# Altium schematic sheet Module02.SchDoc
size A
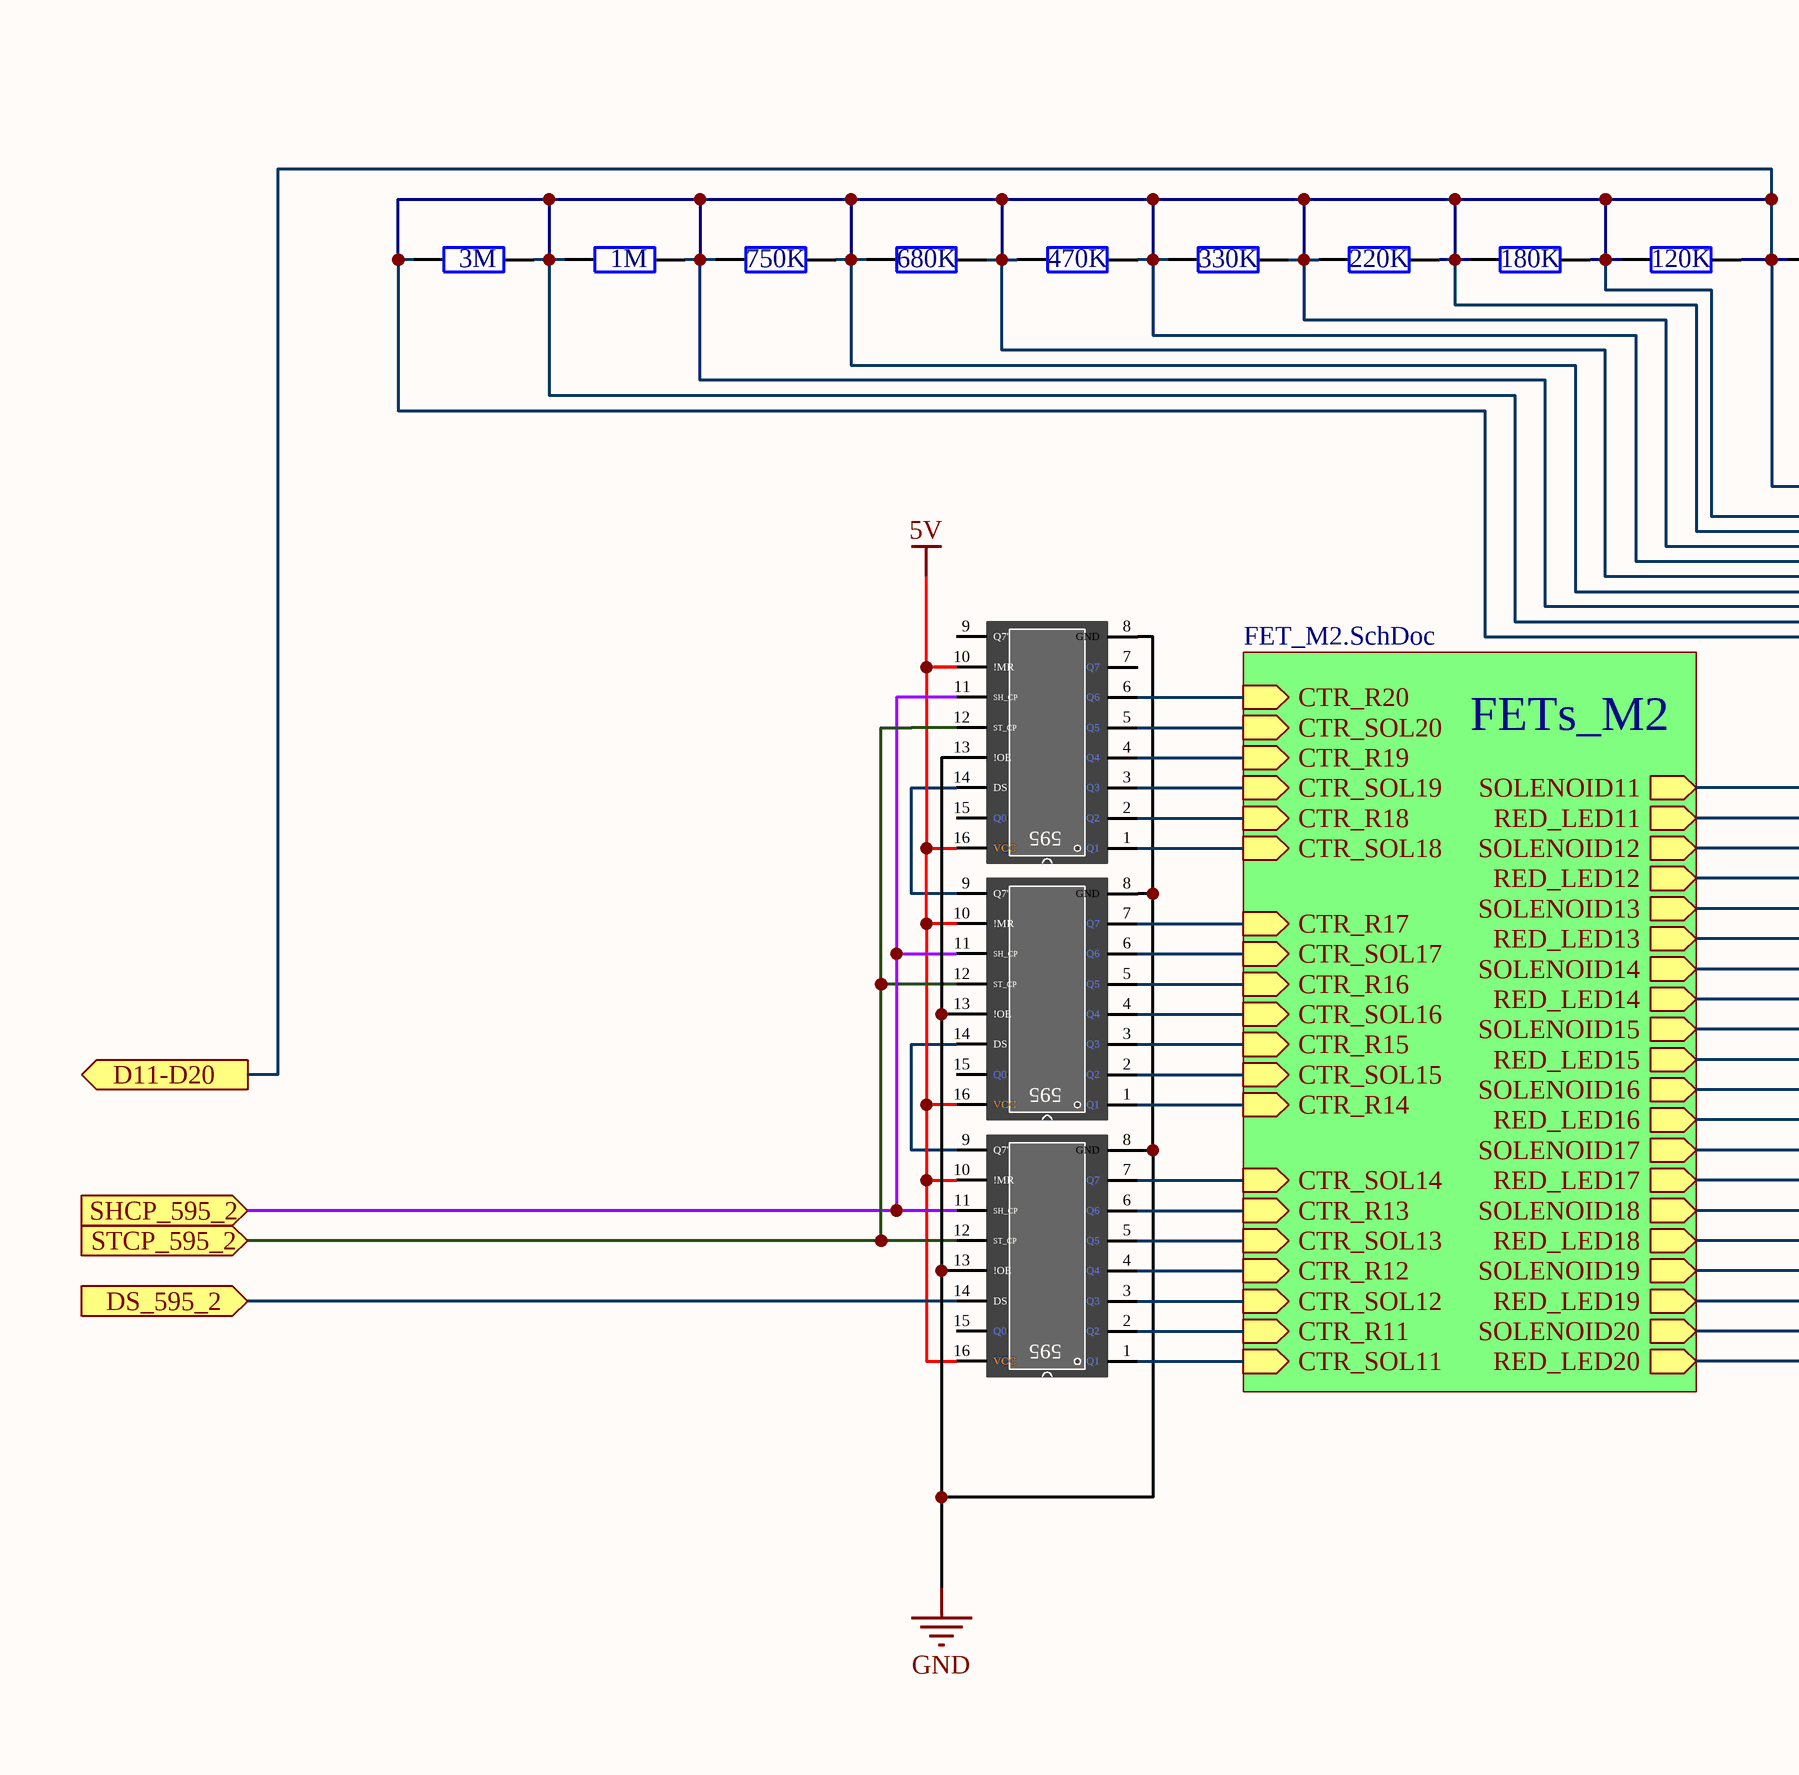
[diagram p0: Module02.SchDoc, left]
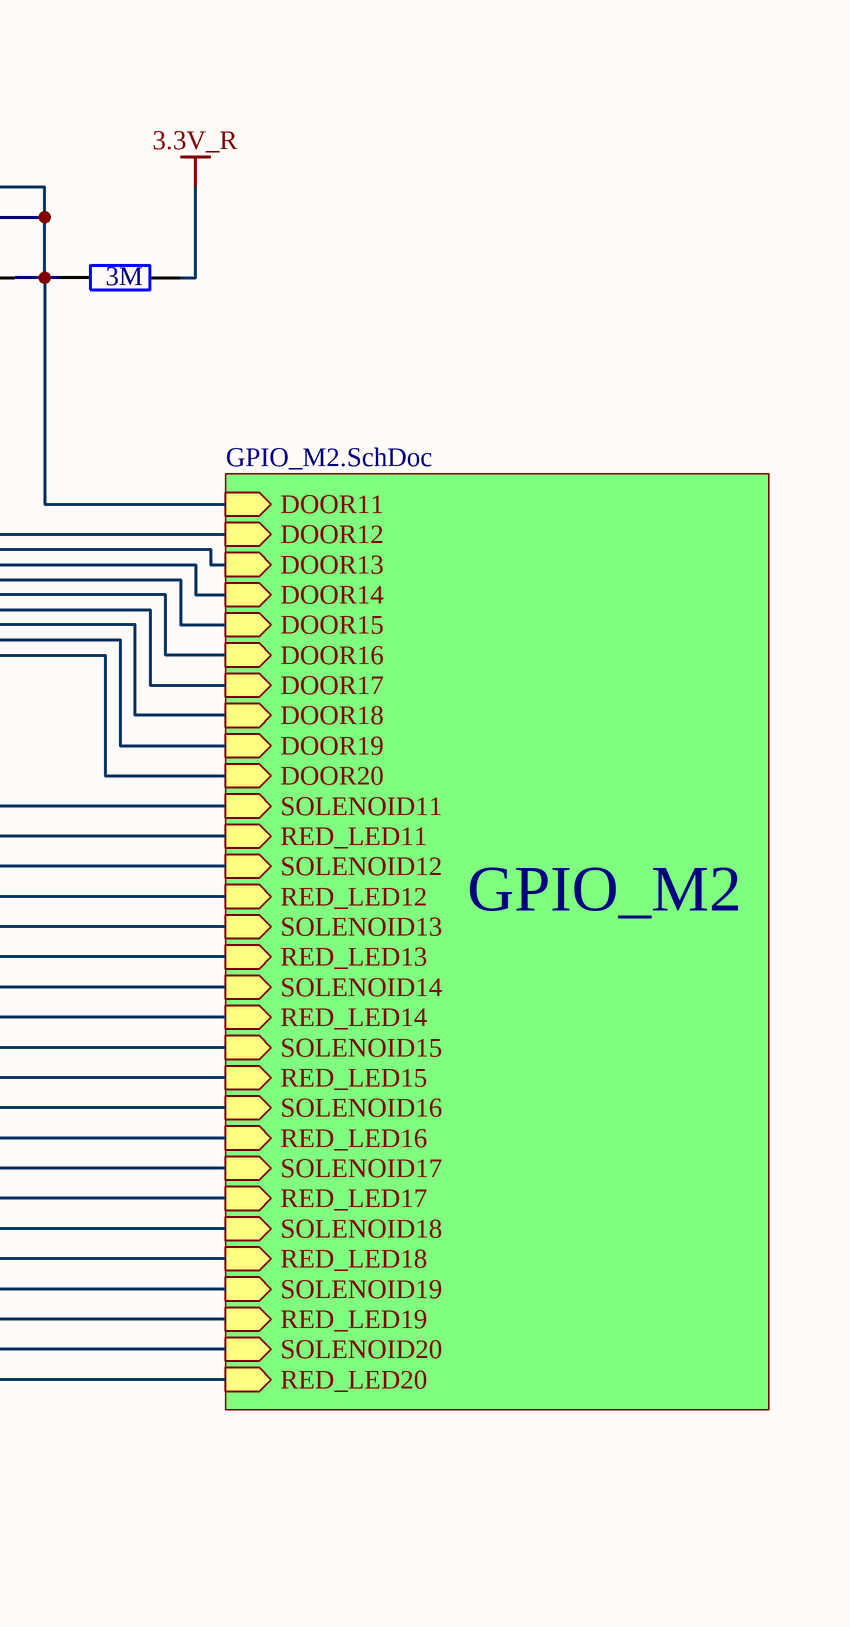
[diagram p1: Module02.SchDoc, right]

## Parts
4  5#HC74595  [5#HC74595]  (value not drawn)
5  5#HC74595  [5#HC74595]  (value not drawn)
6  5#HC74595  [5#HC74595]  (value not drawn)
R11  3M  [AXIAL-0.4]
R12  1M  [AXIAL-0.4]
R58  750K  [AXIAL-0.4]
R59  680K  [AXIAL-0.4]
R60  470K  [AXIAL-0.4]
R61  330K  [AXIAL-0.4]
R62  220K  [AXIAL-0.4]
R63  180K  [AXIAL-0.4]
R64  120K  [AXIAL-0.4]
R65  3M  [AXIAL-0.4]

## Sub-sheets
FETs_M2 = FET_M2.SchDoc: CTR_SOL11 (in), CTR_R11 (in), SOLENOID11 (out), RED_LED11 (out), CTR_SOL14 (in), CTR_R14 (in), SOLENOID14 (out), RED_LED14 (out), CTR_SOL17 (in), CTR_R17 (in), SOLENOID17 (out), RED_LED17 (out), CTR_SOL19 (in), CTR_R19 (in), SOLENOID19 (out), RED_LED19 (out), CTR_SOL12 (in), CTR_R12 (in), SOLENOID12 (out), RED_LED12 (out), CTR_SOL15 (in), CTR_R15 (in), SOLENOID15 (out), RED_LED15 (out), CTR_SOL18 (in), CTR_R18 (in), SOLENOID18 (out), RED_LED18 (out), CTR_SOL20 (in), CTR_R20 (in), SOLENOID20 (out), RED_LED20 (out), CTR_SOL13 (in), CTR_R13 (in), SOLENOID13 (out), RED_LED13 (out), CTR_SOL16 (in), CTR_R16 (in), SOLENOID16 (out), RED_LED16 (out)
GPIO_M2 = GPIO_M2.SchDoc: DOOR11 (in), DOOR12 (in), DOOR13 (in), DOOR14 (in), DOOR15 (in), SOLENOID11 (in), RED_LED11 (in), SOLENOID12 (in), RED_LED12 (in), SOLENOID13 (in), RED_LED13 (in), SOLENOID14 (in), RED_LED14 (in), SOLENOID15 (in), RED_LED15 (in), DOOR16 (in), DOOR17 (in), DOOR18 (in), DOOR19 (in), DOOR20 (in), SOLENOID16 (in), RED_LED16 (in), SOLENOID17 (in), RED_LED17 (in), SOLENOID18 (in), RED_LED18 (in), SOLENOID19 (in), RED_LED19 (in), SOLENOID20 (in), RED_LED20 (in)

## Ports
D11-D20 (out), DS_595_2 (in), SHCP_595_2 (in), STCP_595_2 (in)

## Nets
3.3V_R: R65.1
5V: 4.10(!MR) 4.16(VCC) 5.10(!MR) 5.16(VCC) 6.10(!MR) 6.16(VCC)
GND: 4.8(GND) 4.13(!OE) 5.8(GND) 5.13(!OE) 6.8(GND) 6.13(!OE)
D11-D20: R11.1 R11.2 R12.1 R12.2 R58.1 R58.2 R59.1 R59.2 R60.1 R60.2 R61.1 R61.2 R62.1 R62.2 R63.1 R63.2 R64.1 R64.2 R65.2 ; port D11-D20, sheet GPIO_M2/DOOR11, sheet GPIO_M2/DOOR12, sheet GPIO_M2/DOOR13, sheet GPIO_M2/DOOR14, sheet GPIO_M2/DOOR15, sheet GPIO_M2/DOOR16, sheet GPIO_M2/DOOR17, sheet GPIO_M2/DOOR18, sheet GPIO_M2/DOOR19, sheet GPIO_M2/DOOR20
DS_595_2: 6.14(DS) ; port DS_595_2
SHCP_595_2: 4.11(SH_CP) 5.11(SH_CP) 6.11(SH_CP) ; port SHCP_595_2
STCP_595_2: 4.12(ST_CP) 5.12(ST_CP) 6.12(ST_CP) ; port STCP_595_2
Net4_1: 4.1(Q1) ; sheet FETs_M2/CTR_SOL18
Net4_2: 4.2(Q2) ; sheet FETs_M2/CTR_R18
Net4_3: 4.3(Q3) ; sheet FETs_M2/CTR_SOL19
Net4_4: 4.4(Q4) ; sheet FETs_M2/CTR_R19
Net4_5: 4.5(Q5) ; sheet FETs_M2/CTR_SOL20
Net4_6: 4.6(Q6) ; sheet FETs_M2/CTR_R20
Net4_14: 4.14(DS) 5.9(Q7')
Net5_1: 5.1(Q1) ; sheet FETs_M2/CTR_R14
Net5_2: 5.2(Q2) ; sheet FETs_M2/CTR_SOL15
Net5_3: 5.3(Q3) ; sheet FETs_M2/CTR_R15
Net5_4: 5.4(Q4) ; sheet FETs_M2/CTR_SOL16
Net5_5: 5.5(Q5) ; sheet FETs_M2/CTR_R16
Net5_6: 5.6(Q6) ; sheet FETs_M2/CTR_SOL17
Net5_7: 5.7(Q7) ; sheet FETs_M2/CTR_R17
Net5_14: 5.14(DS) 6.9(Q7')
Net6_1: 6.1(Q1) ; sheet FETs_M2/CTR_SOL11
Net6_2: 6.2(Q2) ; sheet FETs_M2/CTR_R11
Net6_3: 6.3(Q3) ; sheet FETs_M2/CTR_SOL12
Net6_4: 6.4(Q4) ; sheet FETs_M2/CTR_R12
Net6_5: 6.5(Q5) ; sheet FETs_M2/CTR_SOL13
Net6_6: 6.6(Q6) ; sheet FETs_M2/CTR_R13
Net6_7: 6.7(Q7) ; sheet FETs_M2/CTR_SOL14
(unnamed): sheet FETs_M2/SOLENOID11, sheet GPIO_M2/SOLENOID11
(unnamed): sheet FETs_M2/RED_LED11, sheet GPIO_M2/RED_LED11
(unnamed): sheet FETs_M2/SOLENOID14, sheet GPIO_M2/SOLENOID14
(unnamed): sheet FETs_M2/RED_LED14, sheet GPIO_M2/RED_LED14
(unnamed): sheet FETs_M2/SOLENOID17, sheet GPIO_M2/SOLENOID17
(unnamed): sheet FETs_M2/RED_LED17, sheet GPIO_M2/RED_LED17
(unnamed): sheet FETs_M2/SOLENOID19, sheet GPIO_M2/SOLENOID19
(unnamed): sheet FETs_M2/RED_LED19, sheet GPIO_M2/RED_LED19
(unnamed): sheet FETs_M2/SOLENOID12, sheet GPIO_M2/SOLENOID12
(unnamed): sheet FETs_M2/RED_LED12, sheet GPIO_M2/RED_LED12
(unnamed): sheet FETs_M2/SOLENOID15, sheet GPIO_M2/SOLENOID15
(unnamed): sheet FETs_M2/RED_LED15, sheet GPIO_M2/RED_LED15
(unnamed): sheet FETs_M2/SOLENOID18, sheet GPIO_M2/SOLENOID18
(unnamed): sheet FETs_M2/RED_LED18, sheet GPIO_M2/RED_LED18
(unnamed): sheet FETs_M2/SOLENOID20, sheet GPIO_M2/SOLENOID20
(unnamed): sheet FETs_M2/RED_LED20, sheet GPIO_M2/RED_LED20
(unnamed): sheet FETs_M2/SOLENOID13, sheet GPIO_M2/SOLENOID13
(unnamed): sheet FETs_M2/RED_LED13, sheet GPIO_M2/RED_LED13
(unnamed): sheet FETs_M2/SOLENOID16, sheet GPIO_M2/SOLENOID16
(unnamed): sheet FETs_M2/RED_LED16, sheet GPIO_M2/RED_LED16

Not connected (* = marked no-connect by the designer): 4 7(Q7) 9(Q7') 15(Q0); 5 15(Q0); 6 15(Q0)

## Notes on the sheet
- (in symbol 5#HC74595) 595

## Library data of the parts
R11 R12 R58-R65 = Res2: Resistor; Published: 8-Jun-2000; LatestRevisionDate: 17-Jul-2002; LatestRevisionNote: Re-released for DXP Platform.; PackageReference: AXIAL-0.4; Publisher: Altium Limited; PackageDescription: Axial Device, Thru-Hole; 2 Leads; 0.4 in Pin Spacing